# Altium schematic sheet Display and IOs.SchDoc: Display and IOs
size A3; DocumentNumber: 6; SheetNumber: 6; SheetTotal: 6
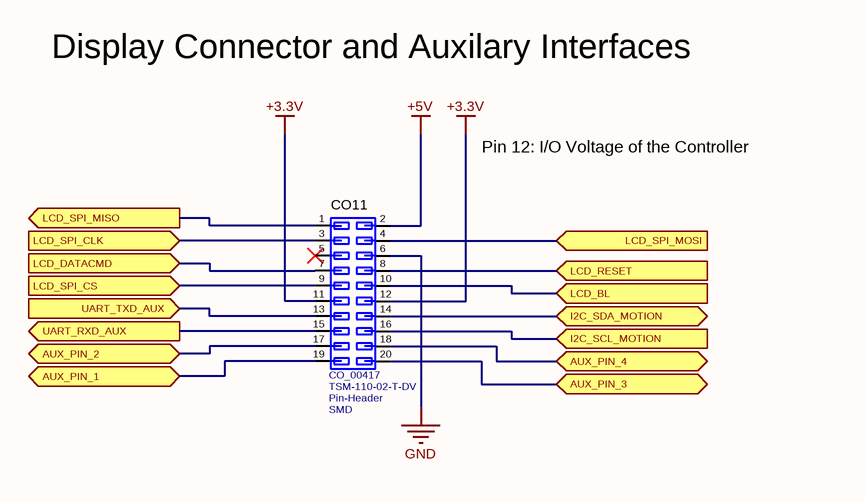
[diagram p0: Display and IOs.SchDoc]

## Parts
CO11  Part_Number: CO_00417  Manufacturer_Number: TSM-110-02-T-DV  Connector_Type: Pin-Header  Mounting: SMD  [CO_00417N]  (hidden comment: header2x10)

## Ports
AUX_PIN_1 (bidir), AUX_PIN_2 (bidir), AUX_PIN_3 (bidir), AUX_PIN_4 (bidir), I2C_SCL_MOTION (in), I2C_SDA_MOTION (bidir), LCD_BL (in), LCD_DATACMD (in), LCD_RESET (in), LCD_SPI_CLK (in), LCD_SPI_CS (in), LCD_SPI_MISO (out), LCD_SPI_MOSI (in), UART_RXD_AUX (out), UART_TXD_AUX (in)

## Nets
+3.3V: CO11.11(PIN11) CO11.12(PIN12)
+5V: CO11.2(PIN2)
GND: CO11.6(PIN6)
AUX_PIN_1: CO11.19(PIN19) ; port AUX_PIN_1
AUX_PIN_2: CO11.17(PIN17) ; port AUX_PIN_2
AUX_PIN_3: CO11.20(PIN20) ; port AUX_PIN_3
AUX_PIN_4: CO11.18(PIN18) ; port AUX_PIN_4
I2C_SCL_MOTION: CO11.16(PIN16) ; port I2C_SCL_MOTION
I2C_SDA_MOTION: CO11.14(PIN14) ; port I2C_SDA_MOTION
LCD_BL: CO11.10(PIN10) ; port LCD_BL
LCD_DATACMD: CO11.7(PIN7) ; port LCD_DATACMD
LCD_RESET: CO11.8(PIN8) ; port LCD_RESET
LCD_SPI_CLK: CO11.3(PIN3) ; port LCD_SPI_CLK
LCD_SPI_CS: CO11.9(PIN9) ; port LCD_SPI_CS
LCD_SPI_MISO: CO11.1(PIN1) ; port LCD_SPI_MISO
LCD_SPI_MOSI: CO11.4(PIN4) ; port LCD_SPI_MOSI
UART_RXD_AUX: CO11.15(PIN15) ; port UART_RXD_AUX
UART_TXD_AUX: CO11.13(PIN13) ; port UART_TXD_AUX

Not connected (* = marked no-connect by the designer): CO11 5(PIN5)*

## Notes on the sheet
- Display Connector and Auxilary Interfaces
- Pin 12: I/O Voltage of the Controller
- Size
- A3
- Rev
- Sheet
- of
- Date changed
- FH  JOANNEUM
- University of Applied Sciences
- Drawn by
- Title
- Check by

## Library data of the parts
CO11 = CO_00417: SMT .025" SQ POST HEADER; Function_type: Wire-to-Board; Connector_gender: male; Pitch_style: 0.00254m; Mounting_angle: 0°; Contact_Count: 20; Row_Count: 2; Contact_coating: Gold; Current: 5.4A; Impedance: 0R; Nominal_AC_Voltage: 475VAC; Nominal_DC_Voltage: 475VDC; Power: 0W; Material: Phosphor-Bronze; Creator: Krenn Markus; Creation_Date: 25.04.2017; Datasheet_Link: http://ibi/dxdb_partdatasheet_download.php?pid=3544